# EAGLE schematic board1_esp8266 (EAGLE 8.6.1)
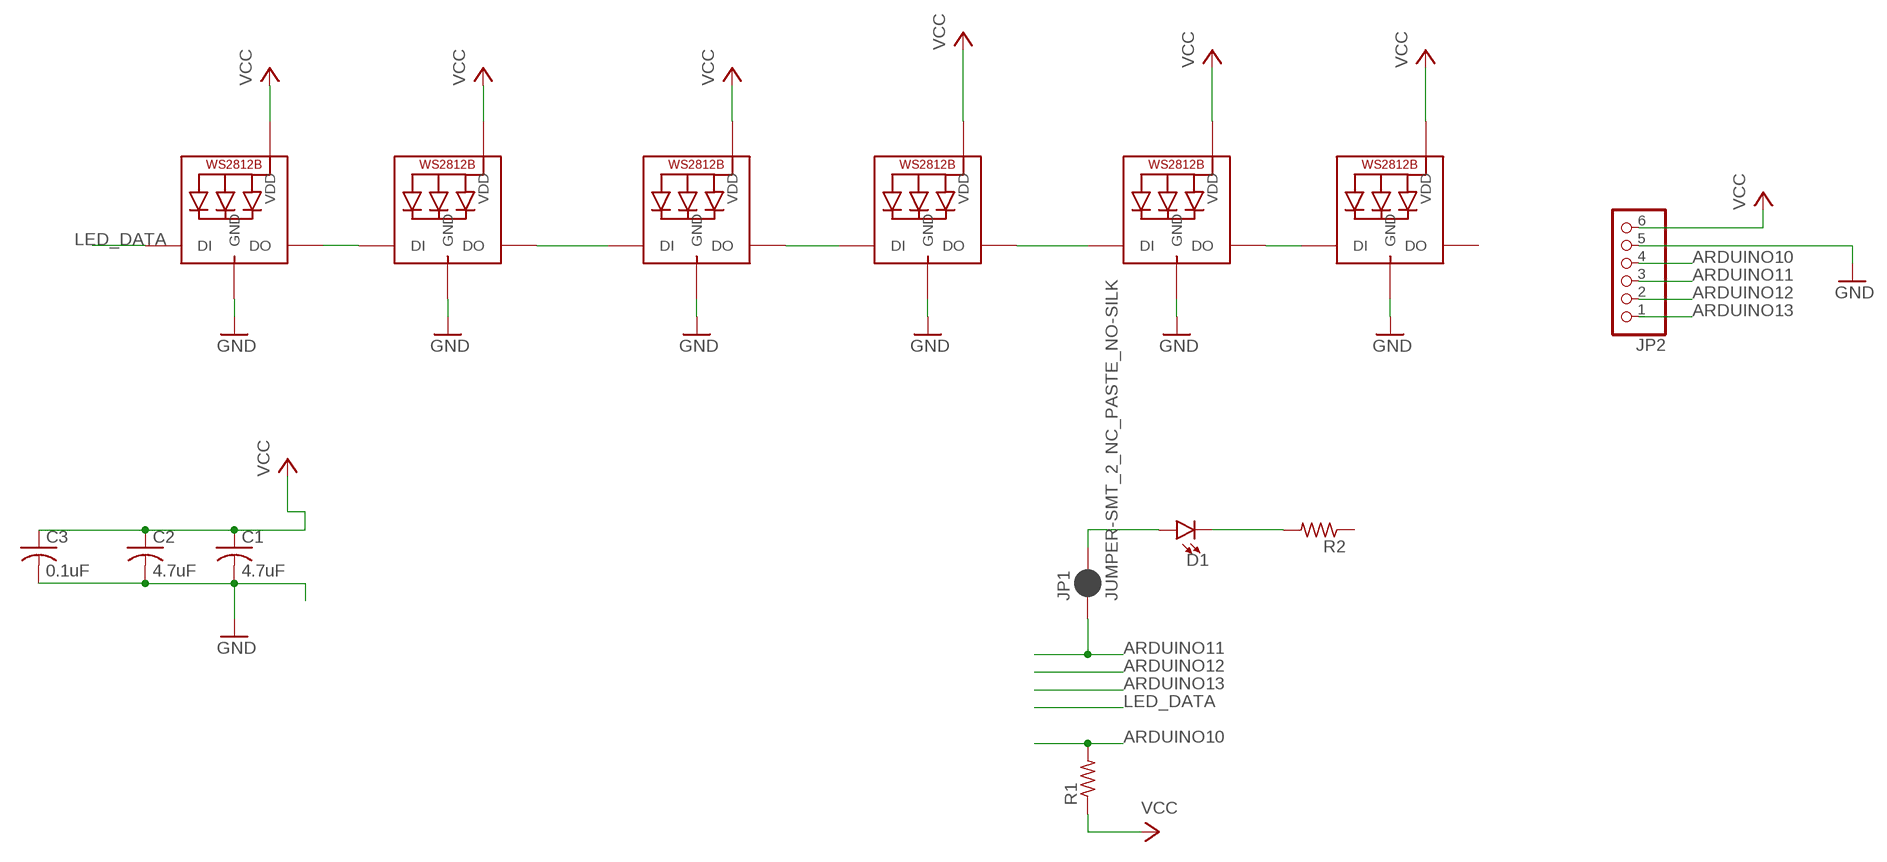
[diagram p0: schematic, sheet 1]

## Parts
C1  4.7uF  C-USC0603  [C0603]
C2  4.7uF  C-USC0603  [C0603]
C3  0.1uF  C-USC0603  [C0603]
D1  LED0603  [LED-0603]
JP1  JUMPER-SMT_2_NC_PASTE_NO-SILK  [SMT-JUMPER_2_NC_PASTE_NO-SILK]
JP2  PINHD-1X6  [1X06]
LED1  WS2812B5050  [WS2812B]
LED2  WS2812B5050  [WS2812B]
LED3  WS2812B5050  [WS2812B]
LED4  WS2812B5050  [WS2812B]
LED5  WS2812B5050  [WS2812B]
LED6  WS2812B5050  [WS2812B]
R1  R-US_R0603  [R0603]
R2  R-US_R0603  [R0603]

## Nets
ARDUINO10: JP2.4 R1.2
ARDUINO11: JP1.1 JP2.3
ARDUINO12: JP2.2
ARDUINO13: JP2.1
GND: C1.2 C2.2 C3.2 JP2.5 LED1.3-GND(GND) LED2.3-GND(GND) LED3.3-GND(GND) LED4.3-GND(GND) LED5.3-GND(GND) LED6.3-GND(GND)
LED_DATA: LED1.4-DIN(DI)
N$2: LED1.2-DOUT(DO) LED2.4-DIN(DI)
N$4: D1.C R2.2
N$8: D1.A JP1.2
N$9: LED2.2-DOUT(DO) LED3.4-DIN(DI)
N$10: LED3.2-DOUT(DO) LED4.4-DIN(DI)
N$11: LED4.2-DOUT(DO) LED5.4-DIN(DI)
N$12: LED5.2-DOUT(DO) LED6.4-DIN(DI)
VCC: C1.1 C2.1 C3.1 JP2.6 LED1.1-VDD(VDD) LED2.1-VDD(VDD) LED3.1-VDD(VDD) LED4.1-VDD(VDD) LED5.1-VDD(VDD) LED6.1-VDD(VDD) R1.1
Unconnected: LED6.2-DOUT(DO) R2.1

## Library data of the parts
C1-C3 = adafruit:C-US: CAPACITOR, American symbol
D1 = SparkFun-LED:LED: LED (Generic) Standard schematic elements and footprints for 5mm, 3mm, 1206, and 0603 sized LEDs. Generic LEDs with no color specified.
JP1 = SparkFun-Jumpers:JUMPER-SMT_2_NC_PASTE: Normally closed solder jumper This jumper has an aperture in the stencil to allow solder paste to bridge the split in the wire so it's normally closed (NC). Wick off the solder to open the connection. Reapply solder to reclose the connection.
JP2 = pinhead:PINHD-1X6: PIN HEADER
LED1-LED6 = adafruit:WS2812B
R1 R2 = adafruit:R-US_: RESISTOR, American symbol